# EAGLE design GYRO (EAGLE 7.5.0)
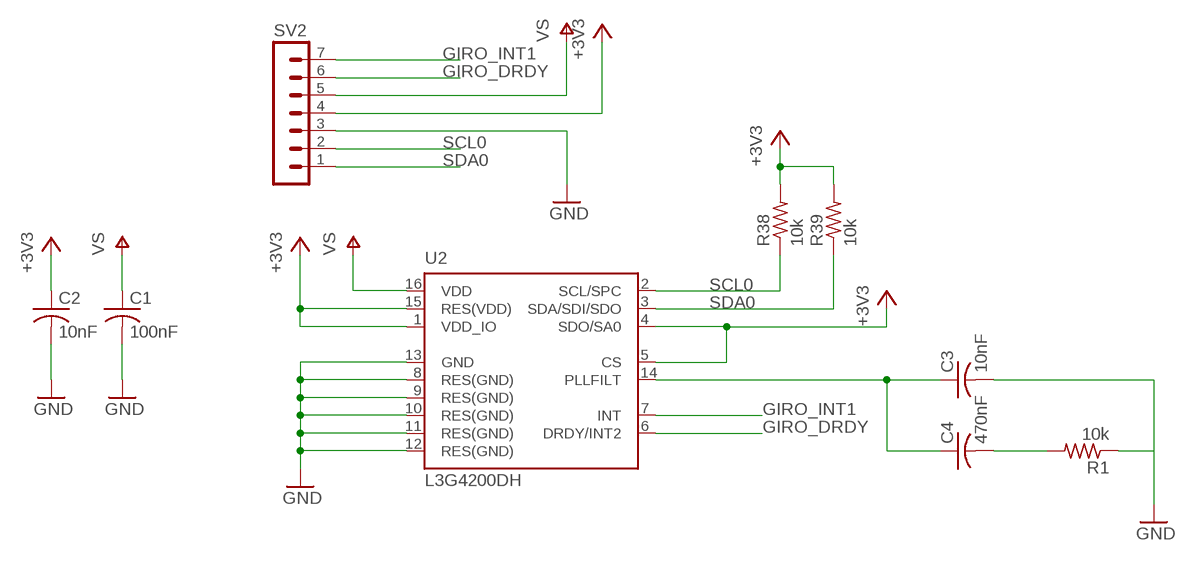
[diagram p0: schematic, sheet 1]

## Parts
C1  100nF  C-USC0805  [C0805]
C2  10nF  C-USC0805  [C0805]
C3  10nF  C-USC0805  [C0805]
C4  470nF  C-USC0805  [C0805]
R1  10k  R-US_R0805  [R0805]
R38  10k  R-US_R0805  [R0805]
R39  10k  R-US_R0805  [R0805]
SV2  MA07-1  [MA07-1]
U2  L3G4200DH  [LGA-16L]

## Nets
+3V3: C2.1 R38.2 R39.2 SV2.4 U2.1(VDD_IO) U2.4(SDO/SA0) U2.5(CS) U2.15(RES(VDD))
GIRO_DRDY: SV2.6 U2.6(DRDY/INT2)
GIRO_INT1: SV2.7 U2.7(INT)
GND: C1.2 C2.2 C3.2 R1.1 SV2.3 U2.8(RES(GND)) U2.9(RES(GND)) U2.10(RES(GND)) U2.11(RES(GND)) U2.12(RES(GND)) U2.13(GND)
N$3: C3.1 C4.1 U2.14(PLLFILT)
N$4: C4.2 R1.2
SCL0: R38.1 SV2.2 U2.2(SCL/SPC)
SDA0: R39.1 SV2.1 U2.3(SDA/SDI/SDO)
V+: C1.1 SV2.5 U2.16(VDD) ; supply symbol labelled VS

## Library data of the parts
C1-C4 = rcl-2:C-US: CAPACITOR, American symbol
R1 R38 R39 = resistor:R-US_: RESISTOR, American symbol
SV2 = con-lstb:MA07-1: PIN HEADER; OC_FARNELL: unknown; OC_NEWARK: unknown
U2 = st-microelectronics-l3g4200dh:L3G4200DH*: L3G4200DH MEMS motion sensor - three-axis digital output gyroscope

## Board
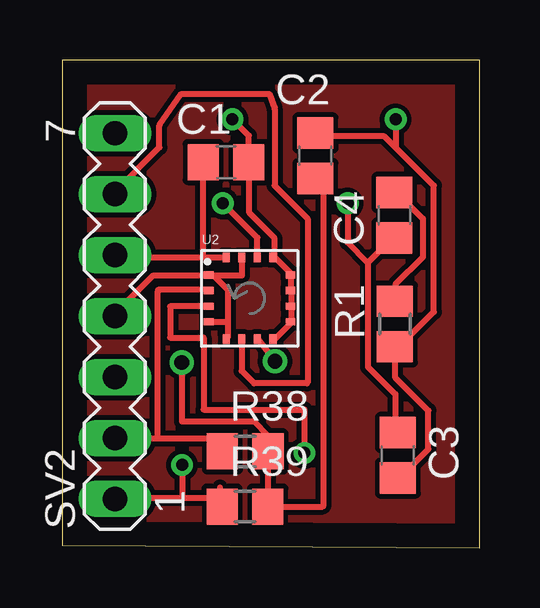
[diagram p1: board, top side]
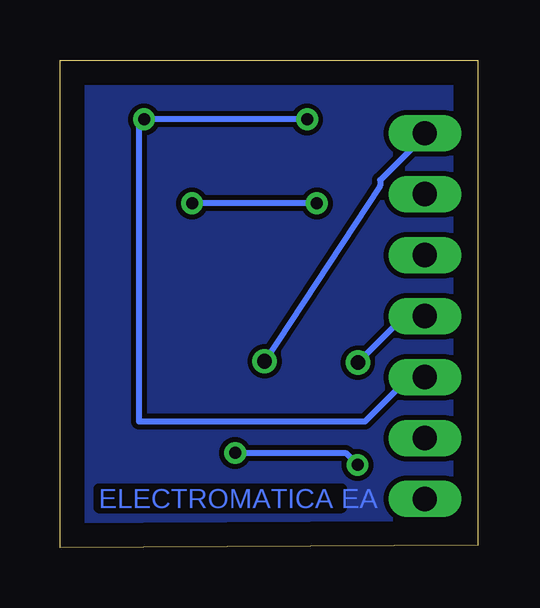
[diagram p2: board, bottom side, seen from below]

Size 17.4 x 20.32 mm. Coordinates in mm from the lower left corner, seen from the top.
Outline: 0,0.1 17.4,0 17.4,20.32 0,20.32 0,0.1
Copper layers (1*16): Top 0.035mm / dielectric 1.5mm / Bottom 0.035mm
Design rules "default": minimum track width 10mil, minimum drill 24mil, track to track 8mil, track to pad 8mil, pad to pad 8mil, via to via 8mil, smd to smd 8mil, copper to edge 40mil, drill to drill 8mil, minimum pad ring 10mil, minimum via ring 8mil, stop-mask expansion 4mil, vias tented up to drill 0mil, thermal gap 10mil

### Footprints (pad centres in the part's own frame; a part is rotated, then mirrored left to right if it is on the bottom)
C0805 = smd 1.3 x 1.5: 1 -0.95,0; 2 0.95,0
R0805 = smd 1.3 x 1.5: 1 -0.95,0; 2 0.95,0
MA07-1 = drill 1.016 long: 1 -7.62,0; 2 -5.08,0; 3 -2.54,0; 4 0,0; 5 2.54,0; 6 5.08,0; 7 7.62,0
LGA-16L = smd 0.4 x 0.3: 1 -1.7,0.975; 2 -1.7,0.325; 3 -1.7,-0.325; 4 -1.7,-0.975; 9 1.7,-0.975; 10 1.7,-0.325; 11 1.7,0.325; 12 1.7,0.975 | smd 0.3 x 0.4: 5 -0.975,-1.7; 6 -0.325,-1.7; 7 0.325,-1.7; 8 0.975,-1.7; 13 0.975,1.7; 14 0.325,1.7; 15 -0.325,1.7; 16 -0.975,1.7

### Placement (x,y rotation side)
C1  6.83,16.06 0 top
C2  10.55,16.33 90 top
C3  13.99,3.85 270 top
C4  13.85,13.85 90 top
R1  13.87,9.32 90 top
R38  7.63,4.01 0 top
R39  7.62,1.71 0 top
SV2  2.2,9.65 90 top
U2  7.81,10.39 0 top

### Tracks (layer width: path | path; a pad name or v marks a point on that pad's centre or on a via)
+3V3  (via drill 0.61)
  Top 0.254: 10.69,15.31 C2.1 10.9,15.03 10.9,1.75 10.86,1.71 R39.2 R38.2 | R38.2 8.58,4.67 8,5.25 5,5.25 5,7.69 v4.99,7.71 | R38.2 | SV2.4 2.2,9.75 3.8,11.35 6.1,11.35 | 6.1,11.35 U2.1 | 6.3,11.35 7.5,11.35 7.5,12.07 U2.15 | 6.1,11.35 6.3,11.35 | 6.3,11.35 6.9,10.75 6.9,9.45 | 6.9,9.45 6.9,8.75 U2.5 | U2.4 6.87,9.41 6.9,9.45
  Bottom 0.254: SV2.4 2.23,9.59 3.1,9.59 v4.99,7.71
GIRO_DRDY
  Top 0.254: U2.6 7.49,7.36 8,6.85 10.2,6.85 10.23,6.88 10.23,13.71 8.86,15.08 8.86,18.28 8.63,18.91 4.97,18.91 4.06,17.6 4.06,16.68 2.23,14.85 SV2.6
GIRO_INT1  (via drill 0.61)
  Top 0.254: v8.87,7.77 8.17,8.68 U2.7
  Bottom 0.254: v8.87,7.77 4.06,15.08 4.06,15.31 2.23,17.14 SV2.7
GND  (via drill 0.5 pad 0.25)
  Top 0.254: 13.89,8.22 13.89,7.08 15.26,5.71 15.26,4.11 14.12,2.96 C3.2 | 13.9,16.67 15.49,15.08 15.49,9.82 13.89,8.22 | 13.9,16.67 13.43,17.14 10.69,17.14 C2.2 | 13.89,8.22 R1.1 | 9.54,9.37 8.86,8.68 U2.8 | 9.54,10.74 9.54,10.05 | 9.54,10.74 9.54,11.42 | 9.54,10.74 U2.11 | 9.54,11.42 8.86,12.11 | 9.54,11.42 U2.12 | 9.54,10.05 9.54,9.37 | 9.54,9.37 U2.9 | 9.54,10.05 U2.10 | 8.86,12.11 U2.13 | 8.86,12.11 8.86,12.89 7.8,13.95 7.8,16.04 C1.2 7.78,17.17 v7.1,17.85 | v13.9,17.85 13.9,16.67
  Bottom 0.254: v7.1,17.85 v13.9,17.85 14.1,17.65 14.1,5.25 4.7,5.25 2.84,7.11 SV2.3
N$1
  pour Bottom: -0.1,20.45 17.5,20.45 17.5,-0.15 -0.1,-0.15
N$2
  pour Top: 0,20.35 17.5,20.35 17.5,-0.05 0,-0.05
N$3  (via drill 0.5 pad 0.25)
  Top 0.254: 12.74,11.88 12.74,7.54 13.89,6.39 13.89,5.02 C3.1 | 12.74,11.88 13.66,12.8 C4.1 | U2.14 8.13,12.91 v6.7,14.35 | v11.9,14.35 11.9,12.73 12.74,11.88
  Bottom 0.254: v6.7,14.35 v11.9,14.35
N$4
  Top 0.254: R1.2 13.89,10.28 13.89,10.97 15.03,12.11 15.03,13.71 13.89,14.85 C4.2
SCL0
  Top 0.254: U2.2 6.12,10.74 4,10.74 4,10.65 3.97,10.65 3.97,4.57 SV2.2 6.68,4.57 R38.1
SDA0  (via drill 0.5 pad 0.25)
  Top 0.254: U2.3 6.12,10.05 4.5,10.05 4.5,8.75 5.9,8.75 5.9,5.75 10.1,5.75 v10.1,3.95 | 6.57,2.51 R39.1 6.34,2.28 6.12,2.05 5,2.05 | 5,2.05 2.23,2.05 SV2.1 | v5,3.45 5,2.05
  Bottom 0.254: v10.1,3.95 5.5,3.95 v5,3.45
V+
  Top 0.254: 5.89,12.11 2.23,12.11 SV2.5 | 5.89,12.11 6.8,12.11 U2.16 | 5.89,12.11 5.89,16.04 C1.1

### Text on the board
Bottom: ELECTROMATICA EA